# Altium schematic sheet ESP32 with USBC.SchDoc
size A2; SheetNumber: 1; SheetTotal: 1
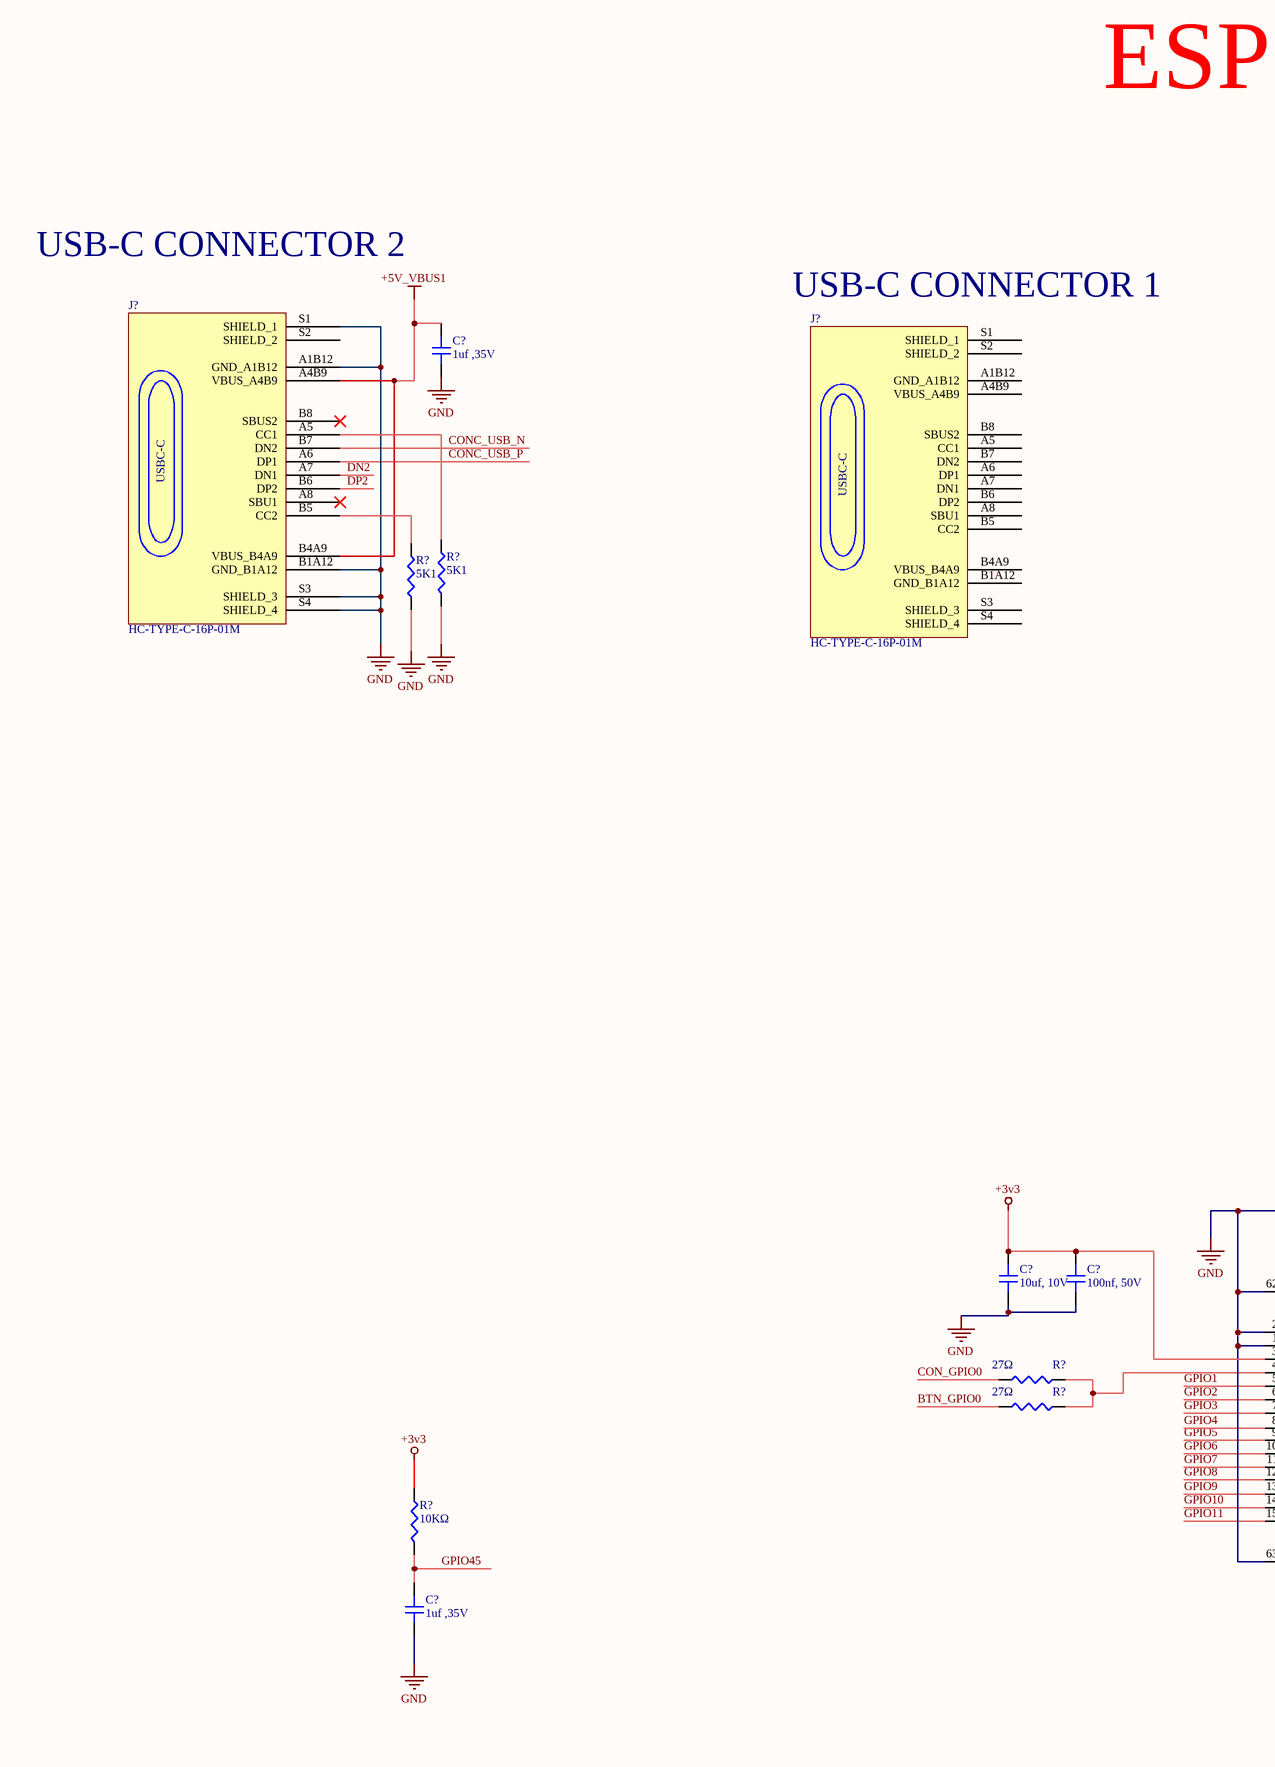
[diagram p0: ESP32 with USBC.SchDoc, left]
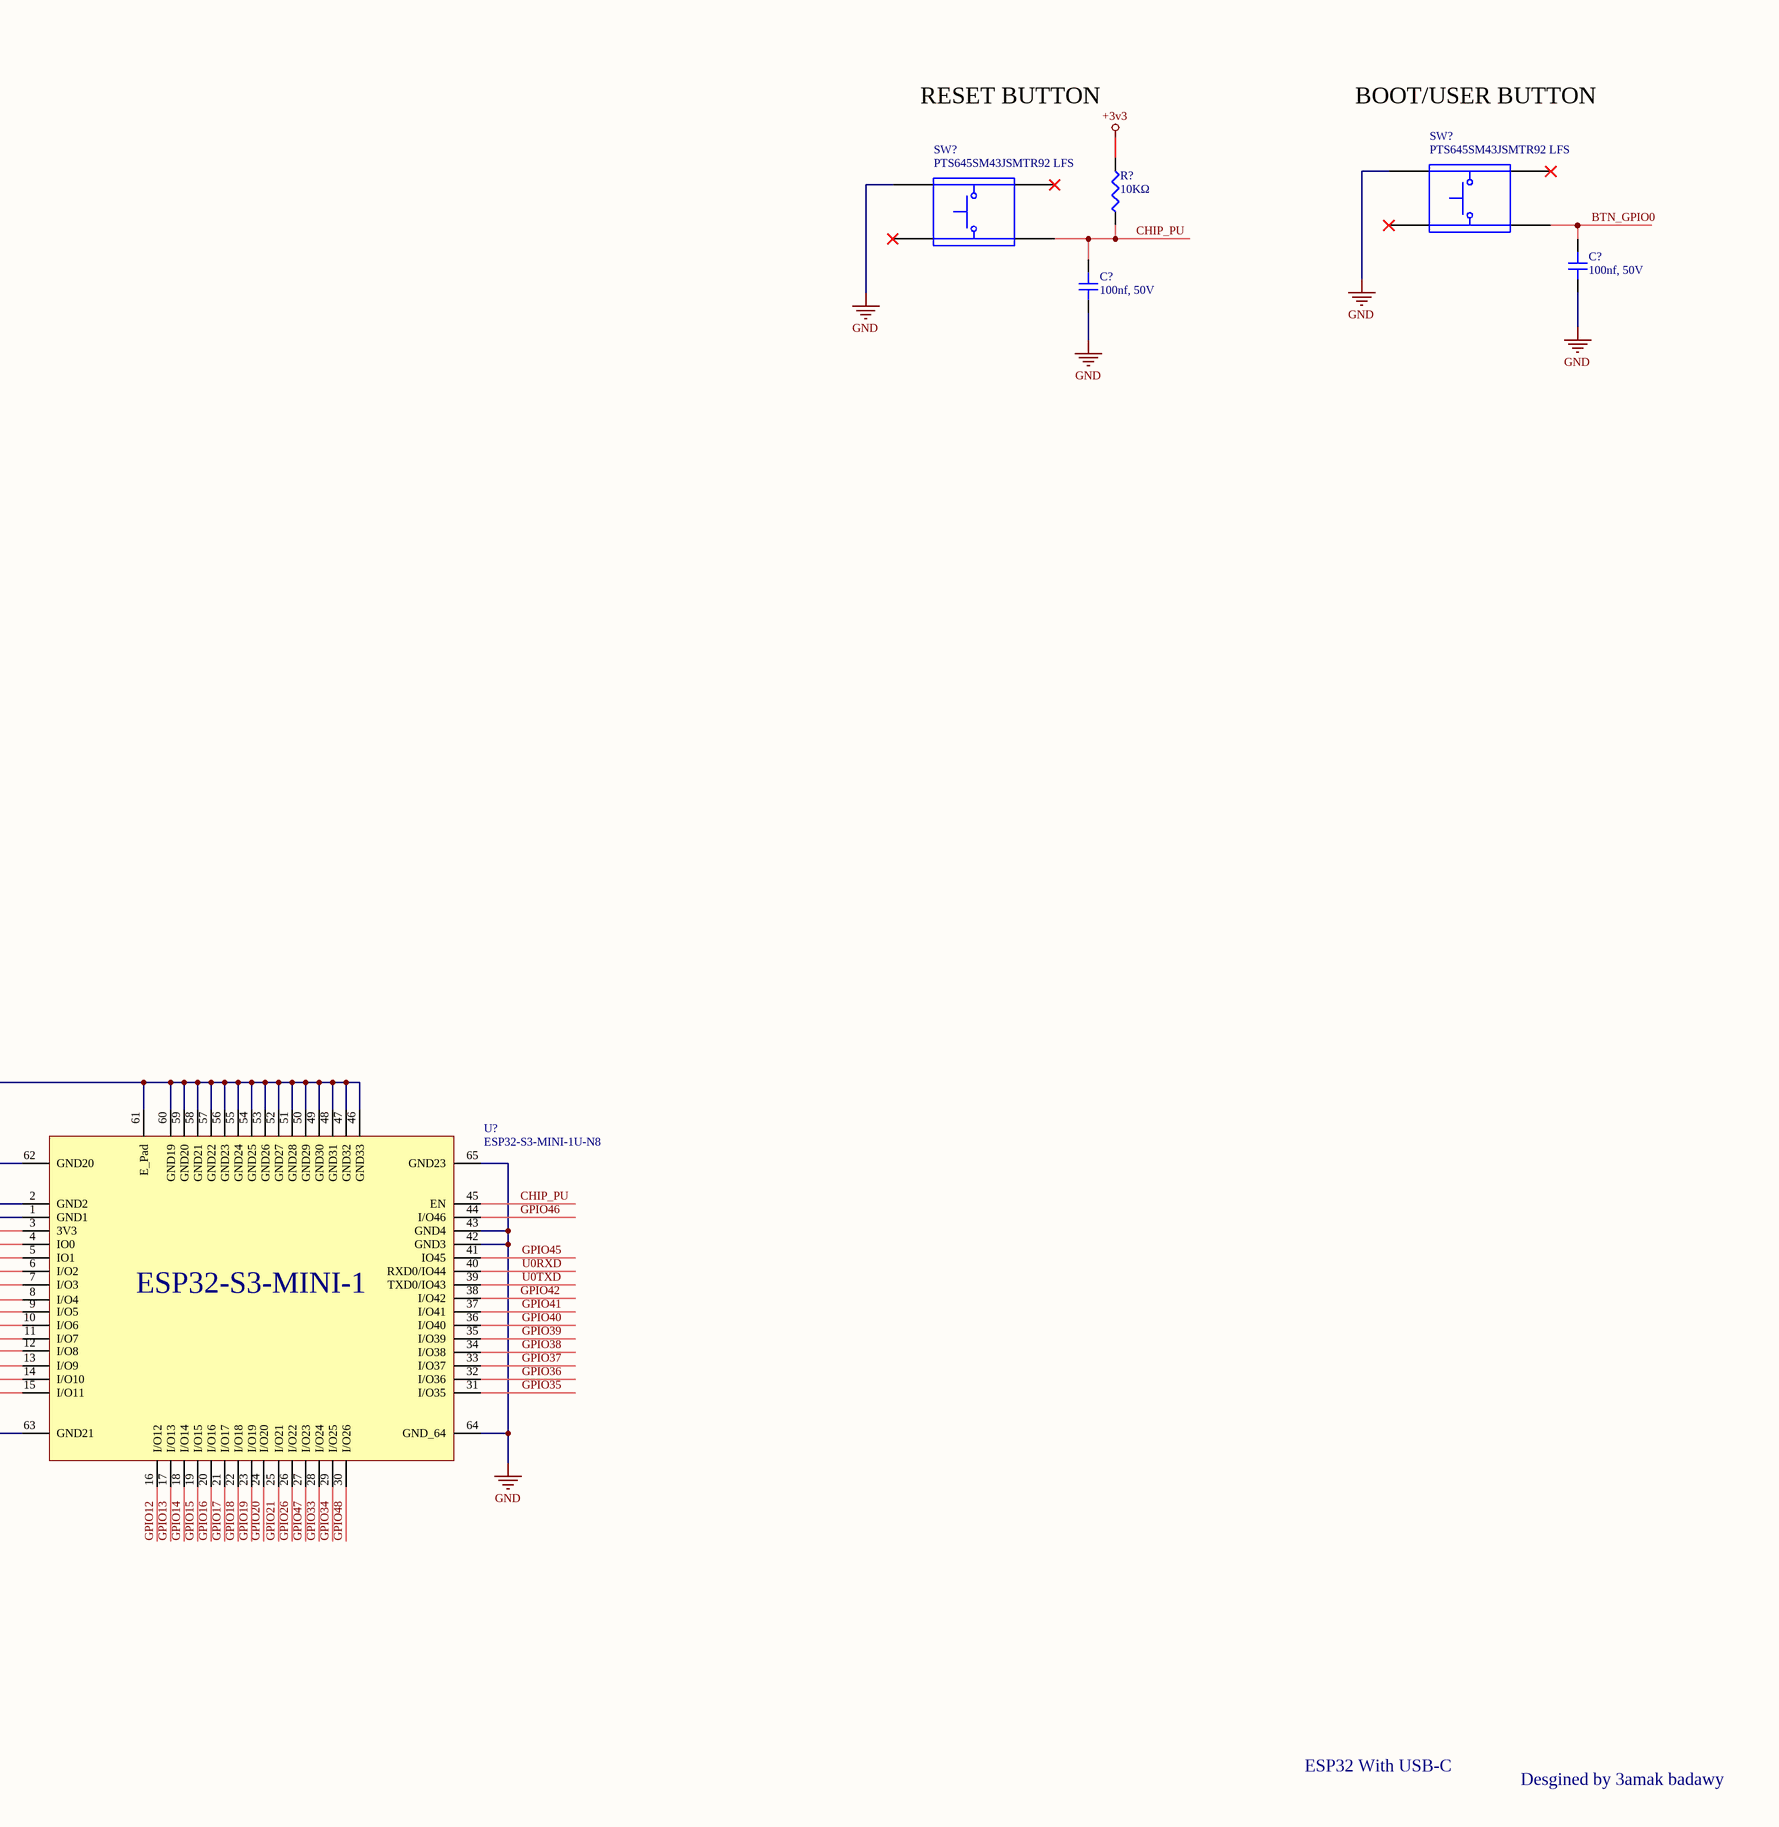
[diagram p1: ESP32 with USBC.SchDoc, right]

## Parts
(Parts that share a designator on the sheet are numbered #1, #2 ... from top to bottom, then left to right.)
C?#1  1uf ,35V
C?#2  100nf, 50V
C?#3  100nf, 50V
C?#4  10uf, 10V
C?#5  100nf, 50V
C?#6  1uf ,35V
J?#1  HC-TYPE-C-16P-01M
J?#2  HC-TYPE-C-16P-01M
R?#1  10KΩ
R?#2  5K1
R?#3  5K1
R?#4  27Ω
R?#5  27Ω
R?#6  10KΩ
SW?#1  PTS645SM43JSMTR92 LFS
SW?#2  PTS645SM43JSMTR92 LFS
U?  ESP32-S3-MINI-1U-N8

## Nets
+3v3: C?#4.2 C?#5.2 R?#1.2 R?#6.2 U?.3(3V3)
+5V_VBUS1: C?#1.2 J?#1.A4B9(VBUS_A4B9) J?#1.B4A9(VBUS_B4A9)
GND: C?#1.1 C?#2.1 C?#3.1 C?#4.1 C?#5.1 C?#6.1 J?#1.A1B12(GND_A1B12) J?#1.B1A12(GND_B1A12) J?#1.S1(SHIELD_1) J?#1.S3(SHIELD_3) J?#1.S4(SHIELD_4) R?#2.1 R?#3.1 SW?#1.1 SW?#2.1 U?.1(GND1) U?.2(GND2) U?.42(GND3) U?.43(GND4) U?.46(GND33) U?.47(GND32) U?.48(GND31) U?.49(GND30) U?.50(GND29) U?.51(GND28) U?.52(GND27) U?.53(GND26) U?.54(GND25) U?.55(GND24) U?.56(GND23) U?.57(GND22) U?.58(GND21) U?.59(GND20) U?.60(GND19) U?.61(E_Pad) U?.62(GND20) U?.63(GND21) U?.64(GND_64) U?.65(GND23)
BTN_GPIO0: C?#2.2 R?#5.1 SW?#1.4
CHIP_PU: C?#3.2 R?#1.1 SW?#2.4 U?.45(EN)
CON_GPIO0: R?#4.1
CONC_USB_N: J?#1.B7(DN2)
CONC_USB_P: J?#1.A6(DP1)
DN2: J?#1.A7(DN1)
DP2: J?#1.B6(DP2)
GPIO1: U?.5(IO1)
GPIO2: U?.6(I/O2)
GPIO3: U?.7(I/O3)
GPIO4: U?.8(I/O4)
GPIO5: U?.9(I/O5)
GPIO6: U?.10(I/O6)
GPIO7: U?.11(I/O7)
GPIO8: U?.12(I/O8)
GPIO9: U?.13(I/O9)
GPIO10: U?.14(I/O10)
GPIO11: U?.15(I/O11)
GPIO12: U?.16(I/O12)
GPIO13: U?.17(I/O13)
GPIO14: U?.18(I/O14)
GPIO15: U?.19(I/O15)
GPIO16: U?.20(I/O16)
GPIO17: U?.21(I/O17)
GPIO18: U?.22(I/O18)
GPIO19: U?.23(I/O19)
GPIO20: U?.24(I/O20)
GPIO21: U?.25(I/O21)
GPIO26: U?.26(I/O22)
GPIO33: U?.28(I/O24)
GPIO34: U?.29(I/O25)
GPIO35: U?.31(I/O35)
GPIO36: U?.32(I/O36)
GPIO37: U?.33(I/O37)
GPIO38: U?.34(I/O38)
GPIO39: U?.35(I/O39)
GPIO40: U?.36(I/O40)
GPIO41: U?.37(I/O41)
GPIO42: U?.38(I/O42)
GPIO45: C?#6.2 R?#6.1 U?.41(IO45)
GPIO46: U?.44(I/O46)
GPIO47: U?.27(I/O23)
GPIO48: U?.30(I/O26)
U0RXD: U?.40(RXD0/IO44)
U0TXD: U?.39(TXD0/IO43)
NetJ?#1_A5: J?#1.A5(CC1) R?#3.2
NetJ?#1_B5: J?#1.B5(CC2) R?#2.2
NetR?#4_2: R?#4.2 R?#5.2 U?.4(IO0)

Not connected (* = marked no-connect by the designer): J?#1 A8(SBU1)* B8(SBUS2)* S2(SHIELD_2); J?#2 A1B12(GND_A1B12) A4B9(VBUS_A4B9) A5(CC1) A6(DP1) A7(DN1) A8(SBU1) B1A12(GND_B1A12) B4A9(VBUS_B4A9) B5(CC2) B6(DP2) B7(DN2) B8(SBUS2) S1(SHIELD_1) S2(SHIELD_2) S3(SHIELD_3) S4(SHIELD_4); SW?#1 2* 3*; SW?#2 2* 3*

## Notes on the sheet
- ESP32 With USB-C
- USB-C CONNECTOR 2
- (near J?#2) USB-C CONNECTOR 1
- RESET BUTTON
- BOOT/USER BUTTON
- Desgined by 3amak badawy
- (in symbol ESP32-S3-MINI-1U-N8) ESP32-S3-MINI-1
- (in symbol USB-C HCTL HC-TYPE-C-16P-01M) USBC-C

## Library data of the parts
C?#1 C?#6 = Cap 1uf: Ceramic Capacitor, 35V, 1uF, Surface Mount; Manufacturer: Samsug Electro-Mechanics; Manufacturer part number: CL05A105KL5NRNC; LCSC Part number: C307413
C?#2 C?#3 C?#5 = Cap 0.1uf: Ceramic Capacitor, 50V, 0.1uF, Surface Mount; Manufacturer: Samsung; Manufacturer Part Number: CL05B104KB54PNC; LCSC Part number: C307331
C?#4 = cap 10uf: Ceramic Capacitor, 10V, 10uF, Surface Mount; Manufacturer: Samsug Electro-Mechanics; Manufacturer part number: CL05A106MP8NUB8; LCSC part number: C307415
J?#1 J?#2 = USB-C HCTL HC-TYPE-C-16P-01M: 5A 1 260℃ Horizontal attachment 16P Female -30℃~+85℃ Gold Copper Type-C SMD USB Connectors ROHS; Manufacturer: HCTL; LCSC Part number: C2894899; Manufacturer part number: HC-TYPE-C-16P-01M
R?#1 R?#6 = Resistor 10KΩ: Res Smd 10KΩ, 35V; Manufacturer: YAGEO; Manufacturer part number: RT1206FRE0710KL; LCSC Part number: C862226
R?#2 R?#3 = Resistor 5.1KΩ: 125mW Thin Film Resistor ±50ppm/℃ ±1% 5.1kΩ 0805 Chip Resistor - Surface Mount ROH; Manufacturer part number: RT0805FRE075K1L; Manufacturer: YAGEO; LCSC Part Number: C869519
R?#4 R?#5 = Resistor 27Ω: 125mW Thin Film Resistor ±25ppm/℃ ±1% 27Ω 0805 Chip Resistor - Surface Mount ROHS; Manufacturer part number: RT0805FRD0727RL; Manufacturer: YAGEO; LCSC Part number: C869052
SW?#1 SW?#2 = Tactile Switch: Tactile Switch 0.05A, 12V; Manufacturer: C&K; LCSC Part number: C2801847; Manufacturer part number: PTS645SM43JSMTR92 LFS
U? = ESP32-S3-MINI-1U-N8: Esp32-S3-mini-1 board; Manufacturer: Espressif Systems; Manufacturer Part Number: ESP32-S3-MINI-1U-N8; LCSC Part Number: C2980299